# EAGLE board Proiect TSC (EAGLE 9.7.0)
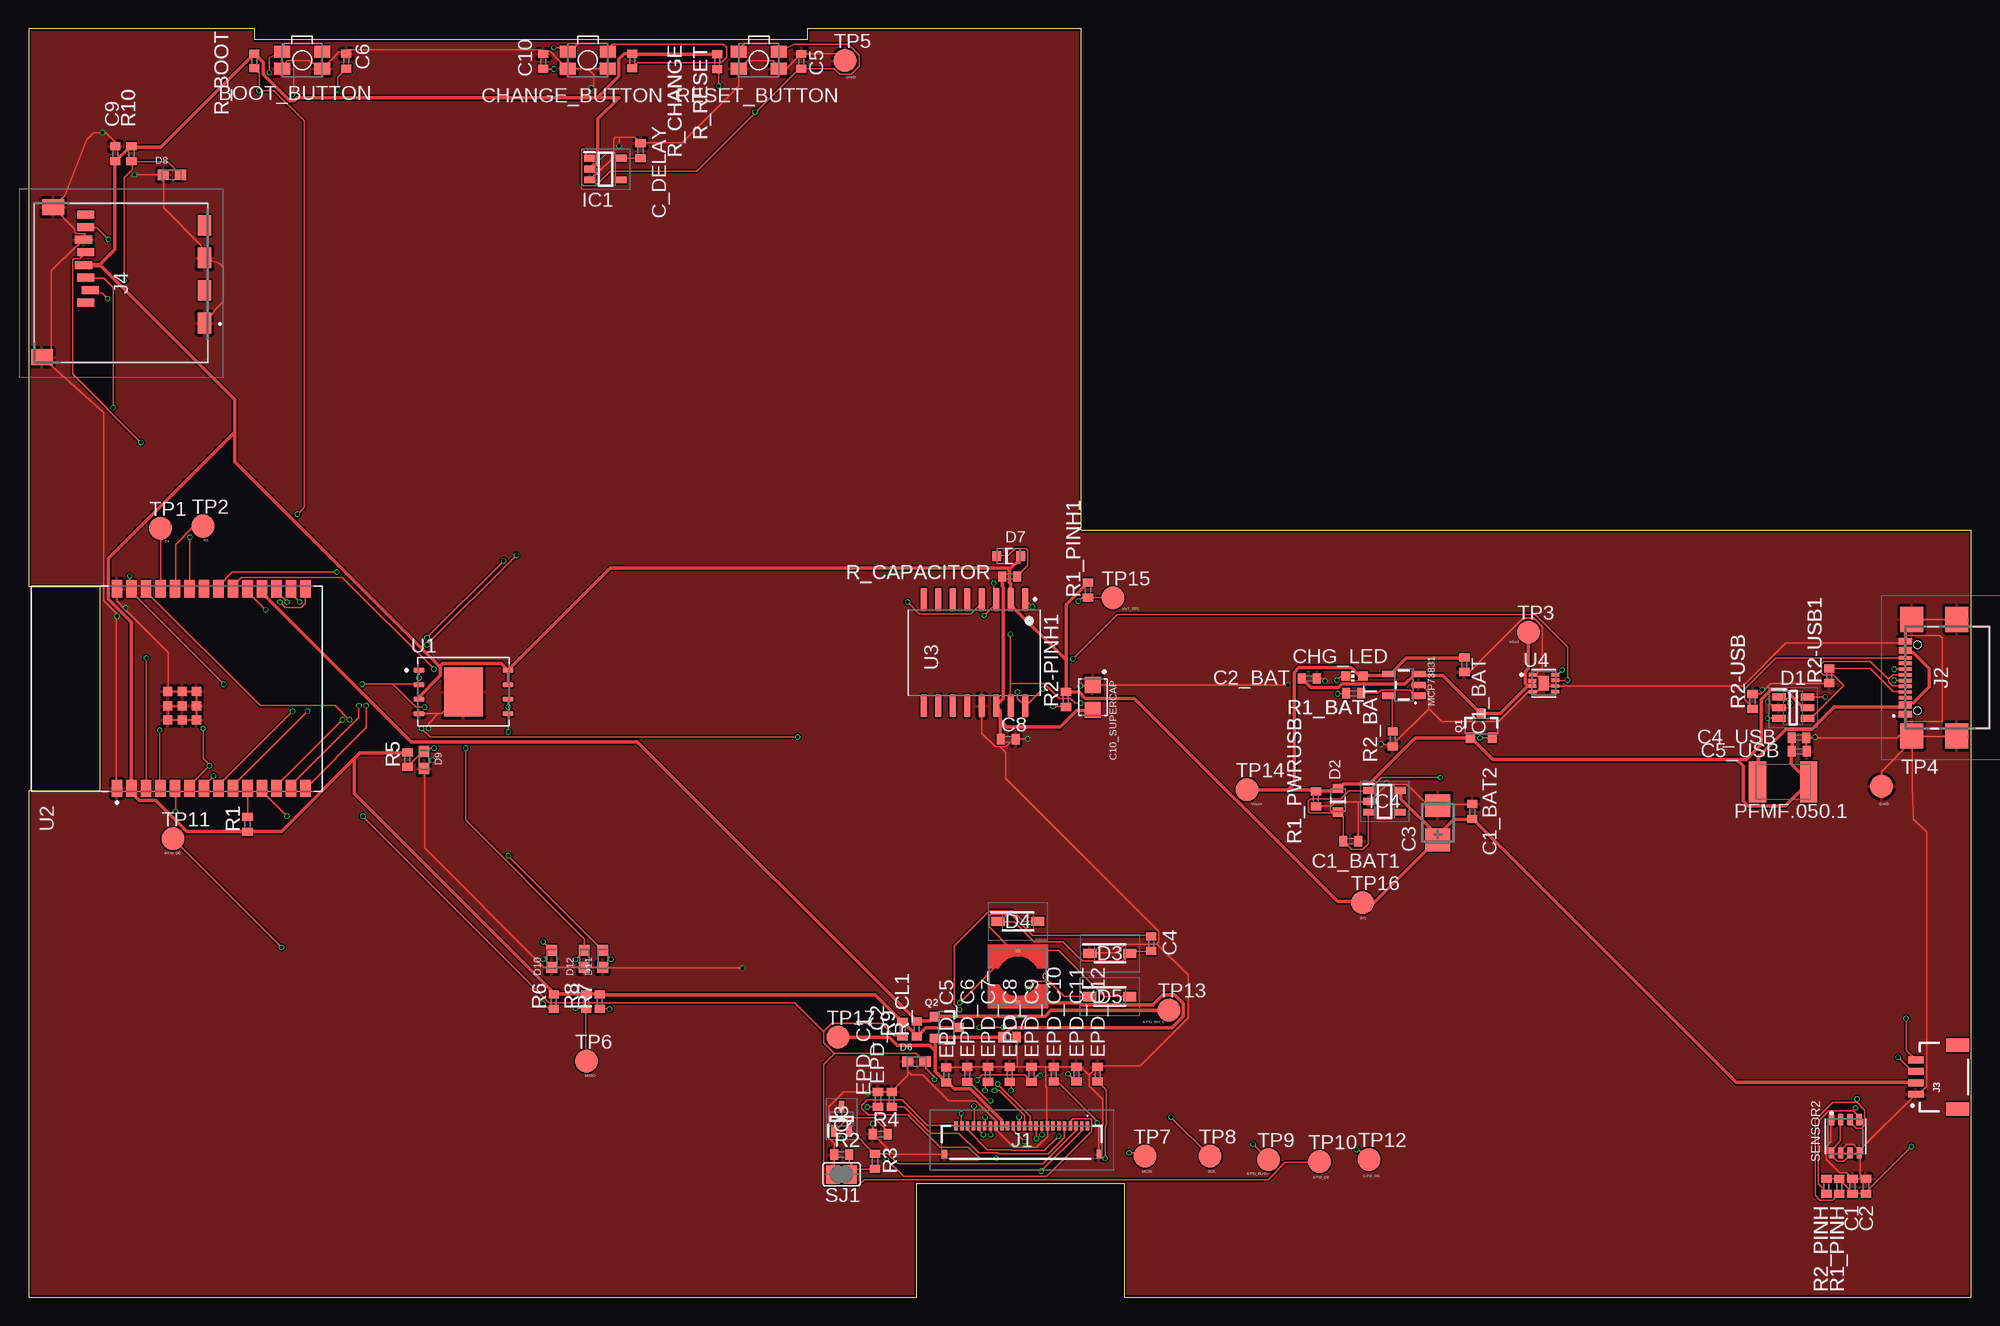
[diagram p1: board, top side]
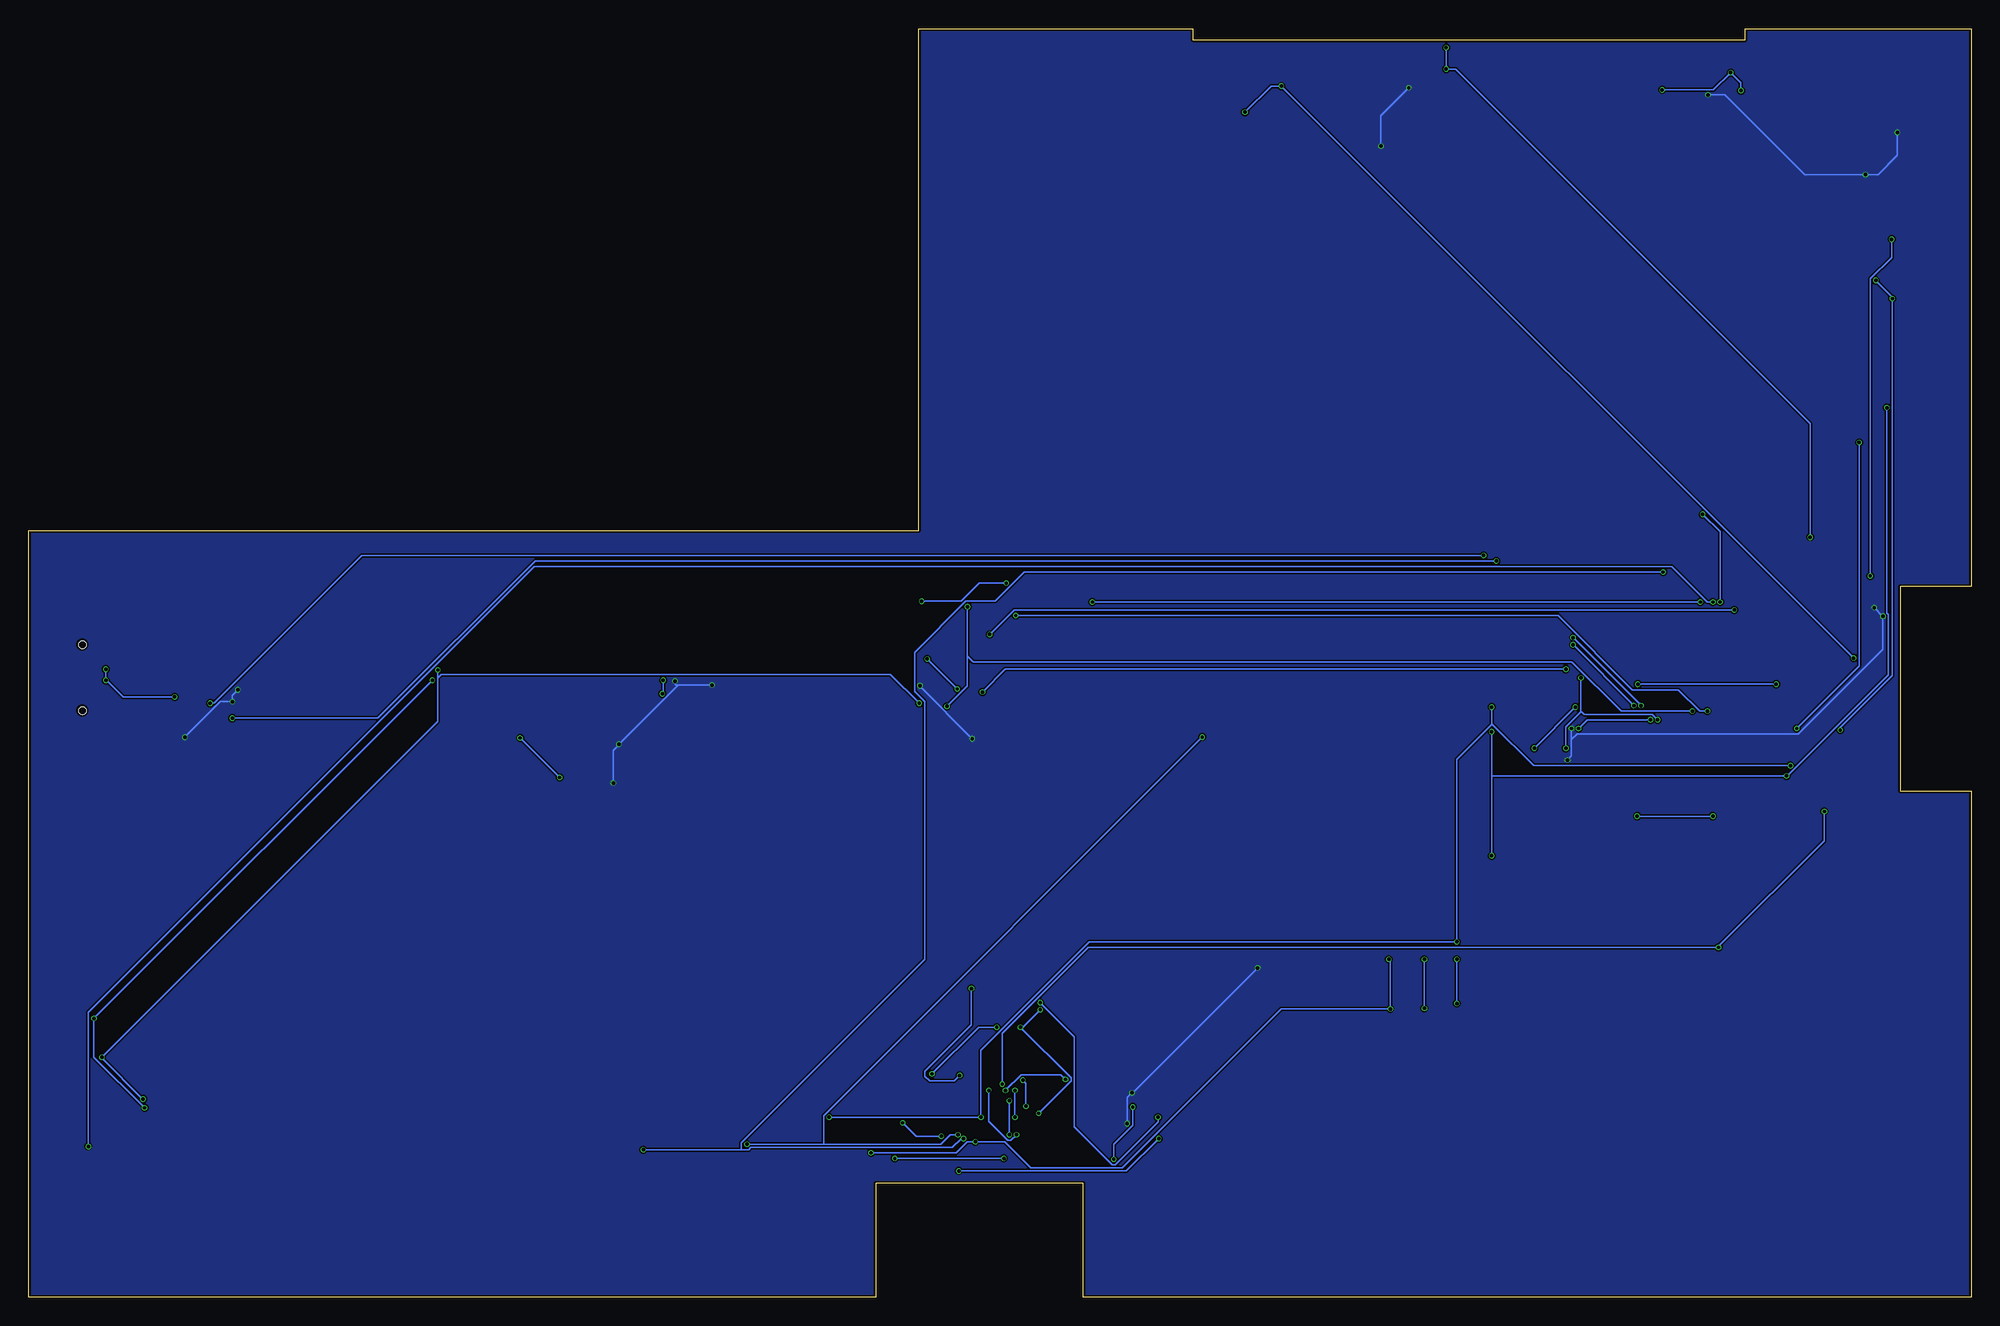
[diagram p2: board, bottom side, seen from below]

Size 170.2 x 111.2 mm. Coordinates in mm from the lower left corner, seen from the top.
Outline: 0,0 77.8,0 77.8,10 96,10 96,0 170.2,0 170.2,67.2 92.2,67.2 92.2,111.2 68.2,111.2 68.2,110.2 19.8,110.2 19.8,111.2 0,111.2 0,62.3 6.25,62.3 6.25,44.4 0,44.4 0,0
Copper layers (1*16): Top 0.035mm / dielectric 1.6mm / Bottom 0.035mm
Design rules "jlcpcb-2layers.dru": minimum track width 5mil, minimum drill 0.3mm, track to track 5mil, track to pad 5mil, pad to pad 5mil, via to via 5mil, smd to smd 5mil, copper to edge 0.2mm, drill to drill 6mil, minimum pad ring 10mil, minimum via ring 3mil, stop-mask expansion 4mil, vias tented up to drill 0mil, thermal gap 10mil
Net classes: 0 default: width 0.15 mm; 1 Power track: width 0.3 mm

## Footprints (pad centres in the part's own frame; a part is rotated, then mirrored left to right if it is on the bottom)
MYBUTTON = smd 1.4 x 1.05: 1 1.75,0.75; 2 -1.75,0.75; 3 -1.75,-0.75; 4 1.75,-0.75
EAGLE-LTSPICE_C0402 = smd 0.7 x 0.9: 1 -0.65,0; 2 0.65,0
RCL_CT3528 = smd 2 x 2.2: + -1.5,0; - 1.5,0
CAPCP3225X100N = smd 1.4 x 1.4: 1 -1.1,0; 2 1.1,0
ADAFRUIT_CHIP-LED0603 = smd 0.8 x 0.8: A 0,-0.75; C 0,0.75
SOT95P280X145-6N = smd 1.2 x 0.6: 1 -1.25,0.95; 2 -1.25,0; 3 -1.25,-0.95; 4 1.25,-0.95; 5 1.25,0; 6 1.25,0.95
ESP32_WROVER_AVX---SD0805S020S1R0_AVX_SD0805S020S1R0_0 = smd 0.8 x 0.9: 1 -1.05,0; 2 1.05,0
SOD3716X135N = smd 1.15 x 0.8: 1 -1.75,0; 2 1.75,0
DIOC1608X36N = smd 0.97 x 0.94: 1 -0.75,0; 2 0.75,0
SOT95P280X120-5N = smd 0.9 x 0.6: 1 -1.4,0.95; 2 -1.4,0; 3 -1.4,-0.95; 4 1.4,-0.95; 5 1.4,0.95
FH34SRJ24S05SH99 = smd 0.3 x 0.8: 1 5.75,1.45; 2 5.25,1.45; 3 4.75,1.45; 4 4.25,1.45; 5 3.75,1.45; 6 3.25,1.45; 7 2.75,1.45; 8 2.25,1.45; 9 1.75,1.45; 10 1.25,1.45; 11 0.75,1.45; 12 0.25,1.45; 13 -0.25,1.45; 14 -0.75,1.45; 15 -1.25,1.45; 16 -1.75,1.45; 17 -2.25,1.45; 18 -2.75,1.45; 19 -3.25,1.45; 20 -3.75,1.45; 21 -4.25,1.45; 22 -4.75,1.45; 23 -5.25,1.45; 24 -5.75,1.45 | smd 0.4 x 0.8: MP1 6.75,-1.05; MP2 -6.75,-1.05
SAMACSYS_PARTS_USB4110GFA = smd 0.3 x 1.15: A1 -3.35,3.678; A4 -2.55,3.678; A5 -1.25,3.678; A6 -0.25,3.678; A7 0.25,3.678; A8 1.25,3.678; A9 2.55,3.678; A12 3.35,3.678; B1 3.05,3.678; B4 2.25,3.678; B5 1.75,3.678; B6 0.75,3.678; B7 -0.75,3.678; B8 -1.75,3.678; B9 -2.25,3.678; B12 -3.05,3.678 | smd 2.18 x 2: MP1 -5.11,-0.827; MP2 5.11,-0.827; MP3 -5.11,3.103; MP4 5.11,3.103 | hole 0.65: -2.89,2.603; 2.89,2.603
JST04_1MM_RA = smd 0.6 x 1.35: 1 -1.5,0; 2 -0.5,0; 3 0.5,0; 4 1.5,0 | smd 1.2 x 2: NC1 2.8,-3.675; NC2 -2.8,-3.675
112ATAARR03ATTEND = smd 1.8 x 1.2: G1 10.6,10.4; G2 4.9,10.4; S1 7.75,10.4; S2 2.05,10.4 | smd 1.4 x 1.9: G3 13.6,-3.85; G4 0.45,-2.85 | smd 0.7 x 1.5: P1 8.8,0; P2 7.7,0.4; P3 6.6,0; P4 5.5,-0.2; P5 4.4,0; P6 3.3,-0.2; P7 2.2,0; P8 1.1,0
IND_4828-WE-TPC_WRE = smd 0.381 x 0.381: 1 -2.286,0; 2 2.286,0
ESP32_WROVER_SPARKFUN-IC-POWER_SOT23-5 = smd 0.55 x 1.2: 1 -0.95,-1.3; 2 0,-1.3; 3 0.95,-1.3; 4 0.95,1.3; 5 -0.95,1.3
ESP32C6_VARISTOR_CT/CN1812 = smd 1.5 x 3.6: 1 -2.25,0; 2 2.25,0
ESP32_WROVER_SPARKFUN-DISCRETESEMI_SOT23-3 = smd 0.8 x 0.9: 1 -0.95,-1; 2 0.95,-1; 3 0,1.1
SOT65P210X110-3N = smd 1.05 x 0.5: 1 -1.05,0.65; 2 -1.05,-0.65; 3 1.05,0
ESP32_WROVER_EAGLE-LTSPICE_R0402 = smd 0.7 x 0.9: 1 -0.65,0; 2 0.65,0
ESP32_WROVER_BME680_PSON80P300X300X100-8N = smd 1.016 x 0.5: 1 1.458,1.2; 2 1.458,0.4; 3 1.458,-0.4; 4 1.458,-1.2; 5 -1.458,-1.22; 6 -1.458,-0.4; 7 -1.458,0.4; 8 -1.458,1.2
SJ = smd 1.168 x 1.6: 1 -0.762,0; 2 0.762,0
TP20R = smd 2 x 2: TP 0,0
SON127P600X800X80-9N = smd 0.94 x 0.44: 1 -3.895,1.905; 2 -3.895,0.635; 3 -3.895,-0.635; 4 -3.895,-1.905; 5 3.895,-1.905; 6 3.895,-0.635; 7 3.895,0.635; 8 3.895,1.905 | smd 3.4 x 4.3: 9 0,0
XCVR_ESP32-C6-WROOM-1-N8 = smd 1.5 x 0.9: 1 -8.75,5.26; 2 -8.75,3.99; 3 -8.75,2.72; 4 -8.75,1.45; 5 -8.75,0.18; 6 -8.75,-1.09; 7 -8.75,-2.36; 8 -8.75,-3.63; 9 -8.75,-4.9; 10 -8.75,-6.17; 11 -8.75,-7.44; 12 -8.75,-8.71; 13 -8.75,-9.98; 14 -8.75,-11.25; 15 8.75,-11.25; 16 8.75,-9.98; 17 8.75,-8.71; 18 8.75,-7.44; 19 8.75,-6.17; 20 8.75,-4.9; 21 8.75,-3.63; 22 8.75,-2.36; 23 8.75,-1.09; 24 8.75,0.18; 25 8.75,1.45; 26 8.75,2.72; 27 8.75,3.99; 28 8.75,5.26 | smd 0.8 x 0.8: 29_1 -2.755,0.79; 29_2 -1.505,0.79; 29_3 -0.255,0.79; 29_4 -2.755,-0.46; 29_5 -1.505,-0.46; 29_6 -0.255,-0.46; 29_7 -2.755,-1.71; 29_8 -1.505,-1.71; 29_9 -0.255,-1.71
SOIC127P1032X265-16N = smd 2.05 x 0.59: 1 -4.655,4.445; 2 -4.655,3.175; 3 -4.655,1.905; 4 -4.655,0.635; 5 -4.655,-0.635; 6 -4.655,-1.905; 7 -4.655,-3.175; 8 -4.655,-4.445; 9 4.655,-4.445; 10 4.655,-3.175; 11 4.655,-1.905; 12 4.655,-0.635; 13 4.655,0.635; 14 4.655,1.905; 15 4.655,3.175; 16 4.655,4.445
SON50P200X200X80-9N = smd 0.76 x 0.27: 1 -0.985,0.75; 4 -0.985,-0.75; 5 0.985,-0.75; 6 0.985,-0.25; 7 0.985,0.25; 8 0.985,0.75 | smd 0.76 x 0.33: 2 -1.01,0.199; 3 -0.985,-0.25 | smd 0.9 x 1.3: 9 0,0

## Placement (x,y rotation side)
BOOT_BUTTON  BUTTON_CUSYOMV1  [MYBUTTON]  23.97,108.41 180 top
C1  100nF  [EAGLE-LTSPICE_C0402]  159.78,9.74 90 top
C1_BAT  4.7uF  [EAGLE-LTSPICE_C0402]  125.78,55.44 270 top
C1_BAT1  4.7uF  [EAGLE-LTSPICE_C0402]  115.83,39.98 0 top
C1_BAT2  4.7uF  [EAGLE-LTSPICE_C0402]  126.47,42.58 90 top
C2  100nF  [EAGLE-LTSPICE_C0402]  160.96,9.74 90 top
C2_BAT  4.7uF  [EAGLE-LTSPICE_C0402]  112.19,54.24 0 top
C3  100uF TANT  [RCL_CT3528]  123.46,41.59 90 top
C4  4.7uF/25V  [EAGLE-LTSPICE_C0402]  98.35,31 90 top
C4_USB  100nF  [EAGLE-LTSPICE_C0402]  155.09,49.06 0 top
C5  1uF  [EAGLE-LTSPICE_C0402]  67.69,108.32 90 top
C5_USB  4.7uF  [EAGLE-LTSPICE_C0402]  155.1,47.86 0 top
C6  100nF  [EAGLE-LTSPICE_C0402]  27.84,108.34 90 top
C7  10uF  [EAGLE-LTSPICE_C0402]  85.93,22.82 0 top
C8  100nF  [EAGLE-LTSPICE_C0402]  85.82,48.92 0 top
C9  100nF  [EAGLE-LTSPICE_C0402]  7.6,100.22 90 top
C10  100nF  [EAGLE-LTSPICE_C0402]  45.08,108.32 90 top
C10_SUPERCAP  CPH3225A  [CAPCP3225X100N]  93.23,52.58 270 top
C_DELAY  100nF  [EAGLE-LTSPICE_C0402]  53.61,100.5 90 top
CHANGE_BUTTON  BUTTON_CUSYOMV1  [MYBUTTON]  48.99,108.41 180 top
CHG_LED  [ADAFRUIT_CHIP-LED0603]  116.15,54.45 90 top
D1  USBLC6-2SC6Y  [SOT95P280X145-6N]  154.58,51.68 0 top
D2  SD0805S020S1R0  [ESP32_WROVER_AVX---SD0805S020S1R0_AVX_SD0805S020S1R0_0]  114.71,43.57 90 top
D3  MBR0530  [SOD3716X135N]  94.73,30.16 0 top
D4  MBR0530  [SOD3716X135N]  86.67,32.96 0 top
D5  MBR0530  [SOD3716X135N]  94.71,26.36 0 top
D6  PGB1010603MR  [DIOC1608X36N]  77.78,20.68 0 top
D7  ESP32_WROVER_AVX---SD0805S020S1R0_AVX_SD0805S020S1R0_0_0AVX_SD0805S020S1R0_0_0  [ESP32_WROVER_AVX---SD0805S020S1R0_AVX_SD0805S020S1R0_0]  85.86,64.97 0 top
D8  PGB1010603MR  [DIOC1608X36N]  12.56,98.38 0 top
D9  PGB1010603MR  [DIOC1608X36N]  34.65,47.11 90 top
D10  PGB1010603MR  [DIOC1608X36N]  45.83,29.66 90 top
D11  PGB1010603MR  [DIOC1608X36N]  50.31,29.66 90 top
D12  PGB1010603MR  [DIOC1608X36N]  48.69,29.66 90 top
EPD_C1  1uF/50V  [EAGLE-LTSPICE_C0402]  74.41,17.36 90 top
EPD_C2  1uF/50V  [EAGLE-LTSPICE_C0402]  75.62,17.36 90 top
EPD_C5  0.1uF/50V  [EAGLE-LTSPICE_C0402]  80.39,19.5 90 top
EPD_C6  1uF/50V  [EAGLE-LTSPICE_C0402]  82.23,19.56 90 top
EPD_C7  1uF/50V  [EAGLE-LTSPICE_C0402]  84.04,19.56 90 top
EPD_C8  1uF/50V  [EAGLE-LTSPICE_C0402]  85.95,19.56 90 top
EPD_C9  1uF/50V  [EAGLE-LTSPICE_C0402]  87.86,19.56 90 top
EPD_C10  1uF/50V  [EAGLE-LTSPICE_C0402]  89.81,19.58 90 top
EPD_C11  1uF/50V  [EAGLE-LTSPICE_C0402]  91.79,19.58 90 top
EPD_C12  1uF/50V  [EAGLE-LTSPICE_C0402]  93.65,19.58 90 top
IC1  BD5229G-TR  [SOT95P280X120-5N]  50.55,98.88 0 top
IC4  XC6220A331MR-G  [SOT95P280X120-5N]  118.79,43.48 0 top
J1  FH34SRJ-24S-0.5SH_99_  [FH34SRJ24S05SH99]  87.01,13.58 0 top
J2  SAMACSYS_PARTS_USB4110-GF-A  [SAMACSYS_PARTS_USB4110GFA]  168.08,54.31 90 top
J3  QWIIC_RIGHT_ANGLE  [JST04_1MM_RA]  165.32,19.32 90 top
J4  112A-TAAR-R03_ATTEND  [112ATAARR03ATTEND]  5.02,95.98 270 top
L1  68uH  [IND_4828-WE-TPC_WRE]  86.67,28.15 270 top
MCP73831  ESP32_WROVER_SPARKFUN-IC-POWER_MCP73831  [ESP32_WROVER_SPARKFUN-IC-POWER_SOT23-5]  120.48,53.68 90 top
PFMF.050.1  ESP32C6_VARISTORCN1812  [ESP32C6_VARISTOR_CT/CN1812]  153.71,45.18 0 top
Q1  20V/4.2A/52mΩ/1.4W  [ESP32_WROVER_SPARKFUN-DISCRETESEMI_SOT23-3]  127.27,50.06 0 top
Q2  20V/4.2A/52mΩ/1.4W  [ESP32_WROVER_SPARKFUN-DISCRETESEMI_SOT23-3]  80.39,23.66 270 top
Q3  SI1308EDL-T1-GE3  [SOT65P210X110-3N]  71.21,15.64 90 top
R1  10K  [ESP32_WROVER_EAGLE-LTSPICE_R0402]  19.18,41.46 90 top
R1_BAT  200  [ESP32_WROVER_EAGLE-LTSPICE_R0402]  116.1,52.94 0 top
R1_PINH  10K  [ESP32_WROVER_EAGLE-LTSPICE_R0402]  158.61,9.73 90 top
R1_PINH1  10K  [ESP32_WROVER_EAGLE-LTSPICE_R0402]  92.81,62 90 top
R1_PWRUSB  100k  [ESP32_WROVER_EAGLE-LTSPICE_R0402]  112.77,43.7 90 top
R2  2.2  [ESP32_WROVER_EAGLE-LTSPICE_R0402]  71.23,12.52 0 top
R2-PINH1  10K  [ESP32_WROVER_EAGLE-LTSPICE_R0402]  90.87,52.4 90 top
R2-USB  5k1  [ESP32_WROVER_EAGLE-LTSPICE_R0402]  151.02,52.24 90 top
R2-USB1  5k1  [ESP32_WROVER_EAGLE-LTSPICE_R0402]  157.75,54.48 90 top
R2_BAT  2K  [ESP32_WROVER_EAGLE-LTSPICE_R0402]  119.51,48.94 90 top
R2_PINH  10K  [ESP32_WROVER_EAGLE-LTSPICE_R0402]  157.49,9.73 90 top
R3  0.47  [ESP32_WROVER_EAGLE-LTSPICE_R0402]  74.15,11.92 90 top
R4  10k  [ESP32_WROVER_EAGLE-LTSPICE_R0402]  74.61,14.32 0 top
R5  10K  [ESP32_WROVER_EAGLE-LTSPICE_R0402]  33.19,47.12 90 top
R6  10K  [ESP32_WROVER_EAGLE-LTSPICE_R0402]  46.01,25.92 90 top
R7  10K  [ESP32_WROVER_EAGLE-LTSPICE_R0402]  50.03,25.92 90 top
R8  10K  [ESP32_WROVER_EAGLE-LTSPICE_R0402]  48.85,25.92 90 top
R9  10K  [ESP32_WROVER_EAGLE-LTSPICE_R0402]  76.57,23.52 90 top
R10  10K  [ESP32_WROVER_EAGLE-LTSPICE_R0402]  9.02,100.22 90 top
R_BOOT  10K  [ESP32_WROVER_EAGLE-LTSPICE_R0402]  19.78,108.36 90 top
R_CAPACITOR  15  [ESP32_WROVER_EAGLE-LTSPICE_R0402]  85.94,63.18 0 top
R_CHANGE  10K  [ESP32_WROVER_EAGLE-LTSPICE_R0402]  52.89,108.36 90 top
R_CL1  10K  [ESP32_WROVER_EAGLE-LTSPICE_R0402]  77.8,23.54 90 top
R_RESET  10K  [ESP32_WROVER_EAGLE-LTSPICE_R0402]  60.33,108.3 90 top
RESET_BUTTON  BUTTON_CUSYOMV1  [MYBUTTON]  63.98,108.41 180 top
SENSOR2  BME688  [ESP32_WROVER_BME680_PSON80P300X300X100-8N]  159.15,14.13 90 top
SJ1  [SJ]  71.22,10.78 0 top
TP1  TPTP20R  [TP20R]  11.56,67.4 0 top
TP2  TPTP20R  [TP20R]  15.28,67.6 0 top
TP3  TPTP20R  [TP20R]  131.4,58.3 0 top
TP4  TPTP20R  [TP20R]  162.32,44.8 0 top
TP5  TPTP20R  [TP20R]  71.54,108.4 0 top
TP6  TPTP20R  [TP20R]  48.86,20.7 0 top
TP7  TPTP20R  [TP20R]  97.79,12.38 0 top
TP8  TPTP20R  [TP20R]  103.51,12.38 0 top
TP9  TPTP20R  [TP20R]  108.63,12.08 0 top
TP10  TPTP20R  [TP20R]  113.09,11.9 0 top
TP11  TPTP20R  [TP20R]  12.64,40.2 0 top
TP12  TPTP20R  [TP20R]  117.44,12.1 0 top
TP13  TPTP20R  [TP20R]  99.89,25.2 0 top
TP14  TPTP20R  [TP20R]  106.74,44.5 0 top
TP15  TPTP20R  [TP20R]  94.99,61.3 0 top
TP16  TPTP20R  [TP20R]  116.84,34.6 0 top
TP17  TPTP20R  [TP20R]  70.89,22.8 0 top
U1  W25Q512JVEIQ  [SON127P600X800X80-9N]  38.1,53.06 0 top
U2  ESP32-C6-WROOM-1-N8  [XCVR_ESP32-C6-WROOM-1-N8]  13,53.35 90 top
U3  DS3231SN#  [SOIC127P1032X265-16N]  82.85,56.5 270 top
U4  MAX17048G+T10  [SON50P200X200X80-9N]  132.74,53.83 0 top

## Tracks (layer width: path | path; a pad name or v marks a point on that pad's centre or on a via)
3V3
  Top 0.3: D7.2 86.91,64.96 86.91,64.75 85.97,63.81 85.87,63.92 85.7,63.92 | 90.92,55.9 90.92,60.73 92.8,62.6 R1_PINH1.2 | 90.92,55.9 90.92,53.12 R2-PINH1.2 91.06,53.05 92.03,53.05 92.59,52.49 96.88,52.49 114.68,34.69 116.75,34.69 TP16.TP 116.89,34.62 117.86,34.62 123.27,40.03 C3.+ | IC4.5 120.22,44.39 120.22,43.7 123.4,40.51 123.4,40.1 C3.+ | C3.+ 123.54,40.58 124.86,41.9 126.45,41.9 C1_BAT2.1 126.59,41.83 149.58,18.84 165.3,18.84 J3.2 | 28.55,47.25 22.16,40.86 19.32,40.86 R1.1 19.11,40.86 13.85,40.86 11.15,43.56 9.7,43.56 9.07,44.18 9.07,44.6 U2.2 9,44.74 9,59.21 6.99,61.22 6.99,64.75 18.07,75.83 | 28.55,47.25 29.02,47.71 33.17,47.71 R5.2 | Q2.3 81.44,23.61 78.6,23.61 77.97,22.99 R_CL1.1 77.84,22.92 76.59,24.17 R9.2 76.45,24.24 74.17,26.52 50.14,26.52 R7.2 50,26.59 48.96,26.59 R8.2 48.82,26.59 46.05,26.59 R6.2 45.98,26.73 28.55,44.16 28.55,47.25 | R_RESET.2 52.95,108.95 R_CHANGE.2 52.2,108.98 51.72,108.5 51.72,107.02 51.55,106.86 51.52,106.86 49.8,105.14 | 36.08,55.33 36.08,54.5 34.21,52.63 34.21,52.49 U1.3 | 36.08,55.33 36.29,55.54 41.41,55.54 41.97,54.98 U1.8 | U1.7 42.03,53.74 42.03,54.85 U1.8 | 8.92,100.81 R10.2 | 36.08,55.33 35.94,55.4 18.07,73.27 18.07,75.83 | 85.7,63.92 50.97,63.92 42.1,55.05 U1.8 | 8.92,100.81 8.84,100.81 C9.1 7.55,99.44 7.55,91.82 6.23,90.51 4.88,90.51 J4.P4 6.36,90.38 18.07,78.67 18.07,75.83 | 8.92,100.81 11.58,100.81 R_BOOT.2 20.54,108.24 20.54,107.17 20.88,106.83 20.93,106.83 22.88,104.89 23.29,104.89 23.54,105.14 49.8,105.14 | 49.8,105.14 51.73,105.14 49.88,103.28 49.88,99.42 49.72,99.25 49.52,99.25 IC1.2 | 90.92,55.9 90.84,55.9 86.01,60.73 86.01,61.01 U3.2 86.03,62.55 85.92,62.66 85.92,63.74 85.75,63.91 85.71,63.91 85.7,63.92
12C_PW
  Top 0.15: SENSOR2.6 159.48,12.6 159.48,12.4 159,11.91 158.44,11.91 157.96,12.4 157.96,12.6 SENSOR2.8 157.96,12.74 157.96,12.95 158.72,13.71 158.72,15.58 SENSOR2.2
32KHZ  (via drill 0.3)
  Top 0.15: v89.75,51.8 90.86,51.8 R2-PINH1.1 | v87.95,60.52 87.32,61.15 U3.1 | v24.45,51.38 17.94,44.87 17.94,44.67 U2.9
  Bottom 0.15: v89.75,51.8 87.95,53.6 87.95,56.2 | v87.95,60.52 87.95,56.2 | v24.45,51.38 30.68,51.38 34.99,55.7 87.45,55.7 87.95,56.2
DN
  Top 0.15: 162.94,54.22 162.94,53.95 163.29,53.6 164.4,53.6 J2.B7 | 162.94,54.22 163.29,54.57 J2.A7 | D1.4 155.88,50.76 156.16,50.76 159.03,53.63 158.1,54.57 157.2,54.57 157.06,54.71 157.06,55.54 157.27,55.75 161.35,55.75 162.88,54.22 162.94,54.22
DP  (via drill 0.3)
  Top 0.15: v163.43,54.08 164.4,54.08 J2.A6 | v163.43,55.05 J2.B6 | v157.41,52.63 D1.6
  Bottom 0.15: v163.43,55.05 v163.43,54.08 163.36,54.08 161.91,52.63 v157.41,52.63
EPD_3V3
  Top 0.3: J1.15 85.73,15.03 85.32,15.03 J1.16 85.25,15.17 85.25,15.51 82.48,18.28 81.09,18.28 80.54,18.84 EPD_C5.1 80.33,18.91 79.43,19.8 79.43,21.6 | 79.43,21.6 79.43,22.64 Q2.2 79.5,22.78 85.25,22.78 C7.1 85.39,22.92 86.08,23.61 100.14,23.61 101.17,24.65 101.17,25.76 100.41,26.52 99.37,26.52 98.47,25.62 92.31,25.62 92.1,25.83 86.7,25.83 L1.2 | TP17.TP 70.91,22.78 75.41,22.78 76.1,22.1 78.93,22.1 79.43,21.6
EPD_3V3_C
  Top 0.3: U2.18 20.5,62.05 20.5,61.7 33.52,48.68 53.32,48.68 77.7,24.31 R_CL1.2 77.84,24.24 79.01,24.24 79.36,24.58 Q2.1 79.5,24.65 89.06,24.65 89.54,25.14 99.86,25.14 TP13.TP
EPD_BUSY  (via drill 0.3)
  Top 0.15: v88.78,14.27 88.78,15.03 J1.9 | v107.27,13.43 108.58,12.12 TP9.TP | v28.12,50.62 26.87,51.87 20.29,51.87 10.32,61.84 10.32,62.05 U2.26 | v34.42,49.86 35.18,49.1 v67.38,49.1
  Bottom 0.15: v88.78,14.27 89.47,14.27 90.3,13.43 100.55,13.43 | v107.27,13.43 100.55,13.43 | v28.12,50.62 33.66,50.62 v34.42,49.86 | v67.38,49.1 100.55,15.93 100.55,13.43
EPD_CS  (via drill 0.3)
  Top 0.15: v84.62,18.14 85.04,18.14 87.25,15.93 87.25,15.1 J1.12 | v79.36,19.11 79.36,19.32 78.6,20.08 78.6,20.64 D6.2 78.46,20.71 77.77,21.4 70.57,21.4 | 69.67,23.34 70.36,24.03 74.72,24.03 75.83,22.92 76.52,22.92 R9.1 | 69.67,23.34 69.67,22.3 70.57,21.4 | v22.64,42.17 20.5,44.32 20.5,44.6 U2.11 | v29.29,42.17 45.64,25.83 67.1,25.83 69.6,23.34 69.67,23.34 | TP10.TP 113.08,11.84 110.11,11.84 108.58,10.32 73.2,10.32 72.64,9.76 69.73,9.76 69.67,9.83 69.67,20.43 70.57,21.33 70.57,21.4
  Bottom 0.15: v84.62,18.14 83.24,19.53 79.78,19.53 v79.36,19.11 | v29.29,42.17 v22.64,42.17
EPD_DC  (via drill 0.3)
  Top 0.15: v84.9,18.7 87.74,15.86 87.74,15.1 J1.11 | v22.16,30.68 12.67,40.16 TP11.TP | v12.88,42.59 12.88,44.6 U2.5
  Bottom 0.15: v84.9,18.7 84.9,23.13 77.35,30.68 v22.16,30.68 22.16,30.75 12.88,40.03 v12.88,42.59
EPD_RST  (via drill 0.3)
  Top 0.15: v88.29,13.92 88.29,15.03 J1.10 | v116.34,12.95 116.55,12.95 117.38,12.12 TP12.TP | v27.01,63.57 17.87,63.57 16.69,62.39 16.69,62.12 U2.21
  Bottom 0.15: v88.29,13.92 88.5,13.92 89.26,13.16 106.92,13.16 107.13,12.95 107.75,12.95 | v116.34,12.95 107.75,12.95 | v27.01,63.57 82.96,63.57 85.52,61.01 88.09,61.01 92.59,56.51 92.59,53.12 91.69,52.22 91.69,29.64 107.75,13.57 107.75,12.95
FLASH_CS  (via drill 0.3)
  Top 0.15: R5.1 33.24,46.54 34.62,47.92 D9.2 34.69,47.92 34.9,48.13 v35.52,48.13 | v34.21,54.29 34.21,54.91 U1.1 | v27.49,50.62 21.74,44.87 21.74,44.67 U2.12
  Bottom 0.15: 34.21,51.31 v34.21,54.29 | 34.21,51.31 35.52,50 v35.52,48.13 | v27.49,50.62 27.98,51.11 33.93,51.11 34.14,51.31 34.21,51.31
GDR  (via drill 0.3)
  Top 0.15: v88.71,11.08 92.24,14.61 92.24,15.03 J1.2 | v71.19,13.92 70.57,14.54 Q3.1 70.64,14.54 71.81,15.72 74.1,15.72 75.21,14.61 75.21,14.34 R4.2
  Bottom 0.15: v88.71,11.08 74.03,11.08 v71.19,13.92
GND  (via drill 0.3)
  Top 0.15: J1.MP2 80.19,12.53 75.76,12.53 74.03,14.27 R4.1 73.96,14.34 v73.96,15.23 | SJ1.1 70.5,10.8 70.57,10.87 70.57,12.46 R2.1 70.57,12.53 70.57,13.5 70.08,13.99 70.08,16.69 71.4,18 73.54,18 | 77.01,19.8 77.01,19.46 75.62,18.07 EPD_C2.2 75.55,18 74.44,18 EPD_C1.2 74.37,18 73.54,18 | 77.01,19.8 77.01,20.64 D6.1 | v73.54,17.94 73.54,18 | EPD_C5.2 82.2,20.15 EPD_C6.2 82.27,20.22 84,20.22 EPD_C7.2 84.07,20.22 85.94,20.22 EPD_C8.2 86.01,20.22 86.63,20.22 | 86.63,20.22 87.81,20.22 EPD_C9.2 87.88,20.22 89.12,20.22 | 89.12,20.22 89.75,20.22 EPD_C10.2 89.89,20.22 91.76,20.22 EPD_C11.2 91.83,20.22 92.17,20.22 92.86,19.53 92.93,19.53 | 86.63,20.22 86.63,22.78 C7.2 | 89.12,20.22 89.12,18.49 89.19,18.42 89.19,15.1 J1.8 89.26,14.13 88.29,13.16 86.28,13.16 84.76,14.68 J1.17 84.69,15.1 84.69,15.51 82.96,17.24 80.61,17.24 78.35,19.5 77.31,19.5 77.01,19.8 | 85.1,48.27 84.69,48.27 83.52,49.44 83.52,51.8 U3.13 | 85.1,48.27 85.66,48.27 86.28,48.89 86.42,48.89 C8.2 86.49,48.96 v87.53,48.96 | 92.93,19.53 92.93,18.56 94.11,17.38 94.11,15.17 93.76,14.82 J1.MP1 | 92.93,19.53 93.63,20.22 EPD_C12.2 93.69,20.29 97.36,20.29 101.59,24.52 101.59,28.25 98.89,30.95 | 98.89,30.95 95.98,30.95 95.22,30.19 93,30.19 D3.1 | 98.89,30.95 98.89,31.02 99.03,31.16 99.03,32.06 85.6,45.49 85.6,47.77 85.1,48.27 | C1_BAT2.2 126.45,43.21 123.54,43.21 123.47,43.14 C3.- 123.4,43.14 122.57,43.14 120.77,44.94 118.97,44.94 | 116.48,43.42 117.38,43.42 IC4.2 117.45,43.42 118.97,44.94 | 116.48,43.42 114.47,43.42 114.12,43.07 112.81,43.07 R1_PWRUSB.1 | 116.48,43.42 116.48,40.03 C1_BAT1.2 | U4.9 132.68,53.81 132.68,53.67 132.13,53.12 131.78,53.12 U4.4 131.71,53.05 131.37,53.05 128.81,50.48 123.82,50.48 122.71,51.59 122.64,51.59
  Top 0.15: U4.9 132.75,53.88 132.06,54.57 131.78,54.57 U4.1 132.06,54.64 132.61,55.19 132.61,58.79 131.85,59.55 130.95,59.55 126.24,54.85 125.83,54.85 C1_BAT.2 | U4.9 132.68,53.6 133.72,53.6 U4.6 133.79,53.6 150.2,53.6 153.94,57.34 164.33,57.34 J2.B1 164.4,57.41 164.4,57.62 J2.A12 164.47,57.69 164.47,58.02 | 122.64,51.59 119.53,48.48 119.53,48.34 R2_BAT.1 119.46,48.48 v118.49,48.48 | 122.64,51.59 122.64,53.05 122.02,53.67 121.81,53.67 MCP73831.2 | v113.57,54.02 113.36,54.22 112.88,54.22 C2_BAT.2 | v110.31,53.67 93.28,53.67 C10_SUPERCAP.1 93.28,53.6 v92.1,53.6 | v118.97,45.08 118.97,44.94 | 160.45,10.39 160.94,10.39 C2.2 | 160.45,10.39 159.83,10.39 C1.2 159.76,10.46 159.28,10.94 158.65,10.94 157.47,12.12 157.47,13.23 157.89,13.64 157.89,15.58 SENSOR2.1 | SENSOR2.7 158.79,12.67 158.79,12.95 159.28,13.43 159.83,13.43 160.31,12.95 160.31,12.67 SENSOR2.5 | SENSOR2.5 160.38,12.88 165.3,17.8 J3.1 165.37,17.87 165.65,17.87 166.27,18.49 166.27,40.79 165.11,41.95 165.09,42.43 165.02,44.8 165.02,48.8 | 160.45,10.39 160.45,12.53 160.38,12.6 SENSOR2.5 | 151.97,53.15 152.63,53.81 157.68,53.81 R2-USB1.1 | 151.97,53.15 151.73,52.91 151.03,52.91 R2-USB.2 | v152.35,52.22 152.84,51.73 153.32,51.73 D1.2 | 151.97,53.15 v151.87,53.25 | 164.47,58.02 164.47,58.93 164.95,59.42 J2.MP4 165.02,59.42 J2.MP2 | C5_USB.2 155.74,47.92 155.74,49.03 C4_USB.2 155.81,49.03 156.5,49.03 | J2.B12 164.4,51.24 J2.A1 164.47,50.9 164.47,50.46 | 164.47,50.46 164.47,49.72 164.95,49.24 J2.MP3 | 156.5,49.03 163.71,49.03 164.4,49.72 J2.MP3 | 165.02,48.8 165.02,49.17 J2.MP3 | J2.MP1 168.9,49.17 165.09,49.17 J2.MP3
  Top 0.15: 164.47,58.02 167.41,58.02 167.63,57.81 167.63,50.46 164.47,50.46 | v156.5,49.1 156.5,49.03 | 35.9,51.18 36.22,51.18 38.09,53.05 U1.9 | 35.9,51.18 34.21,51.18 U1.4 | v35.39,47.09 34.69,46.4 D9.1 34.69,46.33 34.69,39.4 45.15,28.95 45.77,28.95 D10.1 45.84,28.95 48.68,28.95 D12.1 48.75,28.95 50.28,28.95 D11.1 50.34,28.88 v62.53,28.88 | 51.73,101.66 53.12,101.66 53.6,101.17 C_DELAY.2 53.67,101.17 57.27,101.17 62.23,106.13 62.23,107.6 RESET_BUTTON.1 | 51.73,101.66 51.38,101.66 51.24,101.52 51.24,99.94 49.68,98.38 49.6,98.38 IC1.3 | RESET_BUTTON.2 65.24,108.38 | TP5.TP 70.97,108.97 C5.2 | 23.24,108.38 24.55,108.38 BOOT_BUTTON.2 26.49,108.43 26.5,108.43 27.23,109.16 C6.2 27.98,109.35 44.98,109.35 C10.2 45.26,109.21 45.68,109.21 46.41,108.48 | 23.24,108.38 22.61,108.38 BOOT_BUTTON.1 | U2.29_5 13.43,51.8 12.33,51.8 U2.29_2 12.26,51.8 12.26,50.62 U2.29_1 12.33,50.62 13.43,50.62 U2.29_4 13.5,50.62 14.68,50.62 U2.29_7 14.75,50.62 14.75,51.8 U2.29_8 14.75,51.87 14.75,53.05 U2.29_9 14.68,53.12 13.5,53.12 U2.29_6 13.43,53.12 12.26,53.12 U2.29_3 12.26,53.18 12.26,56.51 8.41,60.35 | 8.41,60.35 7.76,61.01 7.76,62.05 U2.28 | J4.G1 16.27,86.41 16.27,86.49 17.04,87.25 17.04,90.3 16.76,90.58 J4.G2 15.15,92.19 11.84,95.49 11.84,98.33 D8.1 11.77,98.4 v9.28,98.4 | C9.2 7.6,101.25 | 7.69,59.69 7.69,59.97 6.58,61.08 6.58,77.54 J4.G3 2.01,82.82 2.01,89.96 4.18,92.14 4.27,92.14 J4.P6 4.96,92.83 4.96,93.23 4.18,93.23 4.06,93.35 4.06,93.64 J4.G4 3.17,96.54 5.1,101.47 5.72,102.09 v6.49,102.09 | 7.69,59.69 7.69,44.67 U2.1 | v8.52,60.45 8.41,60.35 | v7.76,59.69 7.69,59.69
  Top 0.15: 23.24,108.38 23.24,105.79 23.08,105.64 v23.08,105.39 | v51.73,100.9 51.73,101.66 | TP4.TP 162.32,46.1 165.02,48.8 | v35.04,49.86 35.04,50.32 35.9,51.18
  Top 0.152: 7.6,101.25 6.76,102.09 v6.49,102.09 | C5.2 66.38,107.66 RESET_BUTTON.2 | 49,107.66 CHANGE_BUTTON.1 47.23,107.66 46.41,108.48 | 49,107.66 CHANGE_BUTTON.2 | 65.24,108.38 63.01,108.38 62.23,107.6 | v49.3,106.01 49.5,106.21 49.5,107.16 49,107.66
  Bottom 0.15: v73.96,15.23 73.96,17.52 v73.54,17.94 73.47,17.94 v62.53,28.88 | v113.57,54.02 113.57,53.67 113.3,53.67 | 113.3,53.67 v110.31,53.67 | v118.97,45.08 118.97,47.92 118.49,48.41 v118.49,48.48 113.3,53.66 113.3,53.67 | v151.87,53.25 152.35,52.77 v152.35,52.22 153.39,52.22 v156.5,49.1 | v87.53,48.96 92.1,53.53 v92.1,53.6 | 35.04,48.9 35.04,47.44 v35.39,47.09 | 35.04,48.9 v35.04,49.86 | v6.49,102.09 6.49,100.09 8.17,98.4 v9.28,98.4 14.61,98.4 21.6,105.39 v23.08,105.39 | v8.52,60.45 v7.76,59.69 7.76,56.78 15.17,49.38 33.67,49.38 33.7,49.4 34.54,49.4 35.04,48.9 | v49.3,106.01 51.73,103.57 v51.73,100.9
  pour Top: 6.31,44.36 6.29,44.34 6.27,44.32 0.08,44.32 0.08,0.08 77.72,0.08 77.72,10.02 77.74,10.04 77.76,10.06 77.78,10.08 96.02,10.08 96.04,10.06 96.06,10.04 96.08,10.02 96.08,0.08 170.12,0.08 170.12,67.12 92.18,67.12 92.16,67.14 92.14,67.16 92.12,67.18 92.12,111.12 68.28,111.12 68.28,109.98 68.26,109.96 68.24,109.94 68.22,109.92 19.78,109.92 19.76,109.94 19.74,109.96 19.72,109.98 19.72,111.12 0.08,111.12 0.08,62.38 6.27,62.38 6.29,62.36 6.31,62.34 6.33,62.32 6.33,44.38
  pour Bottom: 6.31,44.36 6.29,44.34 6.27,44.32 0.08,44.32 0.08,0.08 77.72,0.08 77.72,10.02 77.74,10.04 77.76,10.06 77.78,10.08 96.02,10.08 96.04,10.06 96.06,10.04 96.08,10.02 96.08,0.08 170.12,0.08 170.12,67.12 92.18,67.12 92.16,67.14 92.14,67.16 92.12,67.18 92.12,111.12 68.28,111.12 68.28,109.98 68.26,109.96 68.24,109.94 68.22,109.92 19.78,109.92 19.76,109.94 19.74,109.96 19.72,109.98 19.72,111.12 0.08,111.12 0.08,62.38 6.27,62.38 6.29,62.36 6.31,62.34 6.33,62.32 6.33,44.38
  pour Top: 6.31,44.36 6.29,44.34 6.27,44.32 0.08,44.32 0.08,0.08 77.72,0.08 77.72,10.02 77.74,10.04 77.76,10.06 77.78,10.08 96.02,10.08 96.04,10.06 96.06,10.04 96.08,10.02 96.08,0.08 170.12,0.08 170.12,67.12 92.18,67.12 92.16,67.14 92.14,67.16 92.12,67.18 92.12,111.12 68.28,111.12 68.28,110.18 68.26,110.16 68.24,110.14 68.22,110.12 19.78,110.12 19.76,110.14 19.74,110.16 19.72,110.18 19.72,111.12 0.08,111.12 0.08,62.38 6.27,62.38 6.29,62.36 6.31,62.34 6.33,62.32 6.33,44.38
GPIO8
  Top 0.15: R1.2 19.18,42.17 19.18,44.6 U2.10
I2C_PW  (via drill 0.3)
  Top 0.15: R2_PINH.2 157.54,10.39 158.58,10.39 R1_PINH.2 158.65,10.32 159.83,9.14 | 159.83,9.14 160.94,9.14 C2.1 160.94,9.21 v164.95,13.23 | 159.83,9.14 C1.1 | v22.64,60.94 21.74,61.84 21.74,62.05 U2.17
  Bottom 0.15: v22.64,60.94 23.13,60.94 26.25,64.06 125.9,64.06 164.95,25 v164.95,13.23
INT_RTC  (via drill 0.3)
  Top 0.15: TP15.TP 94.94,61.35 92.86,61.35 R1_PINH1.1 92.8,61.29 92.24,61.29 v91.96,61.01 | v23.13,51.38 16.69,44.94 16.69,44.67 U2.8 | v83.72,59.76 84.69,60.73 84.69,61.15 U3.3 84.69,61.22 84.55,61.35 v84.55,62.6
  Bottom 0.15: v23.13,51.38 23.82,51.38 25.69,53.25 29.71,53.25 36.22,59.76 v83.72,59.76 | v91.96,61.01 88.5,61.01 86.91,62.6 v84.55,62.6
IO/BOOT  (via drill 0.3)
  Top 0.15: R_BOOT.1 20.19,107.3 v20.19,105.77 21.5,105.77 24.14,103.12 24.14,69.23 v23.55,68.63 | v21.09,107.34 21.09,108.62 BOOT_BUTTON.4 22.39,109.9 25.69,109.9 | C6.1 27.1,106.95 v27.1,105.82 | v22.02,60.94 22.51,60.45 23.89,60.45 24.24,60.8 24.24,62.05 U2.15
  Top 0.152: 25.69,109.9 25.72,109.87 BOOT_BUTTON.3
  Bottom 0.15: v20.19,105.77 20.19,106.44 v21.09,107.34 22.61,105.82 v27.1,105.82 | v22.02,60.94 22.02,67.1 v23.55,68.63
IO/CHANGE  (via drill 0.3)
  Top 0.15: 51.15,109.83 60.87,109.83 61.15,109.55 61.15,108.68 60.67,108.2 53.38,108.2 R_CHANGE.1 | v46.02,107.65 45.1,107.65 C10.1 | v46.02,109.53 46.97,109.53 | v14.13,66.62 14.13,62.12 U2.23 | 50.69,109.9 48.29,109.9 CHANGE_BUTTON.4
  Top 0.152: 50.69,109.9 50.74,109.85 50.74,109.42 | CHANGE_BUTTON.3 50.74,109.42 | 46.97,109.53 47.24,109.26 CHANGE_BUTTON.4 | 50.74,109.42 51.15,109.83
  Bottom 0.15: v46.02,109.53 v46.02,107.65 45.19,107.65 14.13,76.59 v14.13,66.62
MISO  (via drill 0.3)
  Top 0.15: TP6.TP 48.82,20.71 48.82,25.21 R8.1 48.75,25.21 48.61,25.35 v47.92,25.35 | v47.92,29.64 D12.2 48.68,30.47 48.68,31.44 38.3,41.83 v38.3,48.13 | v29.22,53.74 31.92,53.74 | 31.92,53.74 34.14,53.74 U1.2 | v17.11,53.74 9.07,61.77 9.07,62.05 U2.27 9,62.12 8.86,62.26 v8.86,63.23 | v6.99,92.72 5.96,93.76 5.02,93.76 J4.P7 | v34.69,51.73 33.93,51.73 31.92,53.74
  Bottom 0.15: v47.92,25.35 v47.92,29.64 | v17.11,53.74 v29.22,53.74 | v6.99,92.72 6.99,91.13 8.86,89.26 v8.86,63.23 | v34.69,51.73 v38.3,48.13
MOSI  (via drill 0.3)
  Top 0.15: v87.25,13.64 86.28,14.61 86.28,15.03 J1.14 | v96.4,12.67 97.5,12.67 97.78,12.4 TP7.TP | v50.9,25.28 50.07,25.28 R7.1 | v51.04,29.64 50.28,30.4 D11.2 50.28,30.47 v42.03,38.71 | v42.03,49.58 42.03,51.11 U1.5 | v16.2,45.7 15.37,44.87 15.37,44.67 U2.7 | v7.41,77.97 7.41,88.5 6.58,89.33 5.02,89.33 J4.P3
  Bottom 0.15: v96.4,12.67 88.92,12.67 87.95,13.64 v87.25,13.64 84.69,13.64 82.41,11.36 74.37,11.36 60.45,25.28 v50.9,25.28 50.9,29.5 v51.04,29.64 | v42.03,38.71 42.03,45.7 | 42.03,45.7 v42.03,49.58 | 42.03,45.7 v16.2,45.7 16.14,45.7 7.27,54.57 7.27,59.83 7.41,59.97 v7.41,77.97
N$1  (via drill 0.3)
  Top 0.15: v114.61,54.08 114.95,54.43 115.37,54.43 CHG_LED.C | v114.68,52.91 115.44,52.91 R1_BAT.1
  Bottom 0.15: v114.61,54.08 114.61,52.98 v114.68,52.91
N$2
  Top 0.15: R2-USB1.2 161.35,55.12 163.36,53.12 164.4,53.12 J2.A5
N$3  (via drill 0.3)
  Top 0.15: v84.76,12.19 83.31,12.19 82.34,13.16 79.84,13.16 77.01,16 73.54,16 72.99,16.55 72.99,16.83 73.47,17.31 76.52,17.31 78.74,15.1 81.23,15.1 J1.24 | v94.32,12.19 94.32,14.96 94.39,15.03 94.39,18.21 93.69,18.91 EPD_C12.1
  Bottom 0.15: v94.32,12.19 v84.76,12.19
N$4  (via drill 0.3)
  Top 0.15: IC4.3 117.38,39.75 116.89,39.27 115.92,39.27 115.23,39.96 C1_BAT1.1 115.16,40.03 115.16,42.1 114.75,42.52 D2.1 114.68,42.45 112.25,42.45 112.12,42.59 112.12,43.49 112.32,43.7 114.95,43.7 115.65,44.39 117.38,44.39 IC4.1 117.45,44.46 118.56,45.57 v123.68,45.57 | v127.14,49.03 128.18,49.03 Q1.2
  Bottom 0.15: v123.68,45.57 v127.14,49.03
N$5
  Top 0.15: C4.1 98.33,30.33 96.67,30.33 96.53,30.19 D3.2 96.47,30.12 95.84,29.5 92.31,29.5 90.65,31.16 88.09,31.16 86.36,32.89 84.97,32.89 D4.1
N$6
  Top 0.15: R1_BAT.2 116.75,52.98 118.21,52.98 118.49,53.25 120.98,53.25 121.47,52.77 121.74,52.77 MCP73831.1
N$8
  Top 0.15: R2_BAT.2 119.46,49.65 119.46,52.49 119.25,52.7 MCP73831.5
N$9
  Top 0.15: C_DELAY.1 53.6,99.86 53.59,99.83 IC1.5
N$10  (via drill 0.3)
  Top 0.15: v90.23,14.13 88.99,12.88 86.15,12.88 86.08,12.95 84,12.95 82.27,14.68 J1.22 | v93.63,15.3 93.63,15.44 90.16,18.91 89.82,18.91 EPD_C10.1
  Bottom 0.15: v90.23,14.13 92.45,14.13 v93.63,15.3
N$11
  Top 0.15: R2-USB.1 150.97,51.59 150.97,51.8 150.34,52.42 150.34,53.32 153.04,56.02 164.4,56.02 J2.B5
N$12
  Top 0.15: D7.1 84.83,65.03 85.8,65.03 86.42,65.65 87.39,65.65 87.53,65.51 87.53,64.13 86.63,63.23 R_CAPACITOR.2
N$13  (via drill 0.3)
  Top 0.15: v83.65,14.27 83.31,14.61 83.31,15.03 J1.20 | v86.08,18.14 86.08,18.84 86.01,18.91 EPD_C8.1
  Bottom 0.15: v83.65,14.27 84.14,13.78 84.42,13.78 86.08,15.44 v86.08,18.14
N$14  (via drill 0.3)
  Top 0.15: v83.79,15.79 83.79,15.1 J1.19 | v83.79,18.14 83.79,18.7 84,18.91 EPD_C7.1
  Bottom 0.15: v83.79,18.14 v83.79,15.79
N$15  (via drill 0.3)
  Top 0.15: v84.28,14.27 84.28,15.03 J1.18 | v84.28,17.24 84.07,17.24 82.41,18.91 82.27,18.91 EPD_C6.1
  Bottom 0.15: v84.28,17.24 v84.28,14.27
N$23
  Top 0.15: J1.5 90.72,15.03 90.72,13.99 89.33,12.6 84.97,12.6 84.9,12.67 83.24,12.67 81.51,14.4 79.01,14.4 76.73,16.69 75.62,16.69 EPD_C2.1
N$24  (via drill 0.3)
  Top 0.15: v75.14,12.12 76.66,10.6 89.19,10.6 93.14,14.54 93.14,15.51 93,15.65 91.48,15.65 91.27,15.44 91.27,15.1 J1.4 | v73.47,16.69 74.37,16.69 EPD_C1.1
  Bottom 0.15: v75.14,12.12 75.14,13.43 73.47,15.1 v73.47,16.69
PREVGH  (via drill 0.3)
  Top 0.15: v82.82,16.76 82.82,15.1 J1.21 | v83.1,19.04 83.38,19.32 83.38,19.39 83.52,19.53 87.25,19.53 87.81,18.97 EPD_C9.1 87.88,18.97 88.36,19.46 v88.64,19.46 | v87.6,27.08 88.22,27.7 89.4,27.7 90.72,26.38 92.93,26.38 D5.1
  Bottom 0.15: v82.82,16.76 82.82,18.77 v83.1,19.04 | v87.6,27.08 87.6,23.89 91.69,19.8 91.69,19.39 91.27,18.97 89.12,18.97 v88.64,19.46
PREVGL  (via drill 0.3)
  Top 0.15: v81.72,16.14 81.72,15.1 J1.23 | v85.39,23.68 v83.31,23.68 | v91.06,19.6 91.76,18.91 EPD_C11.1 | v81.58,25.21 81.09,25.69 81.09,30.82 84.14,33.86 86.22,33.86 87.12,32.96 88.36,32.96 D4.2
  Bottom 0.15: v81.72,16.14 78.88,18.97 78.88,19.25 v83.31,23.68 83.17,23.61 v81.58,25.21 | v85.39,23.68 86.98,23.68 v91.06,19.6
RESE
  Top 0.15: J1.3 91.76,14.61 88.85,11.7 76.17,11.7 75.28,12.6 74.17,12.6 R3.2 74.1,12.6 72.16,14.54 71.88,14.54 Q3.2
RESE'
  Top 0.15: R3.1 74.1,11.22 72.44,11.22 72.02,10.8 SJ1.2 72.44,11.29 71.88,11.84 71.88,12.46 R2.2
RESET  (via drill 0.3)
  Top 0.15: 65.72,109.9 62.7,109.9 RESET_BUTTON.4 | 63.67,103.84 67.48,107.64 C5.1 70.57,107.67 71.04,107.2 72.09,107.2 72.78,107.89 72.78,108.86 71.81,109.83 67.08,109.83 RESET_BUTTON.3 | 63.67,103.84 58.52,98.68 50.94,98.68 49.68,97.43 48.62,97.43 48.48,97.57 48.48,100.55 48.61,100.69 48.91,100.06 IC1.1 | v60.45,106.16 60.45,107.51 R_RESET.1 | v63.64,103.88 63.67,103.84 | v10.32,56.02 10.32,44.67 U2.3
  Top 0.152: 65.72,109.9 65.73,109.89 RESET_BUTTON.3
  Bottom 0.15: v60.45,106.16 | v60.45,106.16 v10.32,56.02 | v60.45,106.16 61.35,106.16 v63.64,103.88
RTC_RST  (via drill 0.3)
  Top 0.15: v23.75,60.94 22.99,61.7 22.99,62.05 U2.16 | v77.01,60.94 78.05,59.9 82.55,59.9 83.45,60.8 83.45,61.15 U3.4
  Bottom 0.15: v77.01,60.94 v23.75,60.94
RX
  Top 0.15: U2.24 12.88,62.12 12.88,66 14.47,67.59 15.23,67.59 TP2.TP
SCK  (via drill 0.3)
  Top 0.15: v86.77,15.79 86.77,15.1 J1.13 | v100.07,15.79 103.46,12.4 TP8.TP | v45.08,25.76 45.57,25.28 45.98,25.28 R6.1 | v45.08,29.64 45.84,30.4 D10.2 45.77,30.47 v45.08,31.16 | v42.03,51.73 42.03,52.42 U1.6 | U2.6 14.13,44.67 14.13,44.87 v15.86,46.6 15.86,46.67 15.3,47.23 v15.3,49.86 | J4.P5 4.47,91.04 3.98,91.04 3.86,90.92 3.86,80.9 v9.83,74.93
  Bottom 0.15: v100.07,15.79 v86.77,15.79 86.77,21.68 77.28,31.16 v45.08,31.16 45.08,47.16 42.03,50.21 | v45.08,29.64 v45.08,25.76 | 42.03,50.21 v42.03,51.73 | v15.86,46.6 38.36,46.6 41.97,50.21 42.03,50.21 | v9.83,74.93 9.83,55.33 v15.3,49.86
SCL  (via drill 0.3)
  Top 0.15: 159.83,16.34 157.68,16.34 156.78,15.44 156.78,9.97 157.47,9.28 157.47,9.14 R2_PINH.1 | 159.83,16.34 160.31,15.86 160.31,15.65 SENSOR2.4 | v164.47,24.45 164.47,21.68 165.3,20.84 J3.4 | U4.7 133.79,54.08 v134.83,54.08 134.83,56.99 131.99,59.83 95.36,59.83 v91.48,55.95 | v160.04,16.62 159.83,16.41 159.83,16.34 | v35.52,55.05 27.49,63.09 18.63,63.09 17.94,62.39 17.94,62.12 U2.20 | v86.63,53.05 86.63,52.49 87.25,51.87 U3.16 87.32,51.8 v88.85,53.32
  Bottom 0.15: v134.83,54.08 v164.47,24.45 164.47,21.05 v160.04,16.62 | v35.52,55.05 84.62,55.05 v86.63,53.05 | v88.85,53.32 v91.48,55.95
SDA  (via drill 0.3)
  Top 0.15: 160.18,17.11 158.03,17.11 156.5,15.58 156.5,8.93 156.92,8.52 158.03,8.52 158.58,9.07 R1_PINH.1 | 160.18,17.11 160.87,16.41 160.87,15.1 160.59,14.82 160.11,14.82 159.55,15.37 SENSOR2.3 | v134.34,54.98 134,54.64 133.79,54.64 U4.8 | v163.78,21.05 164.95,19.88 165.3,19.88 J3.3 | v160.18,17.38 160.18,17.11 | v20.77,60.25 19.18,61.84 19.18,62.05 U2.19 | 86.01,53.81 86.01,51.87 U3.15 | 86.01,53.81 v86.01,58.1 | v92.17,52.08 91.69,52.08 91.27,52.49 90.3,52.49 88.99,53.81 86.01,53.81
  Bottom 0.15: 134.34,54.3 134.34,50.48 v163.78,21.05 163.78,20.98 v160.18,17.38 | 134.34,54.3 v134.34,54.98 | v20.77,60.25 83.86,60.25 v86.01,58.1 | v92.17,52.08 94.7,54.6 134.04,54.6 134.34,54.3
SRC  (via drill 0.3)
  Top 0.15: 86.15,30.47 84.14,32.48 84.14,33.45 84.28,33.59 86.08,33.59 87.95,31.72 98.33,31.72 C4.2 | 86.15,30.47 86.63,30.47 L1.1 86.7,30.4 90.23,30.4 94.25,26.38 96.4,26.38 D5.2 | v71.26,15.79 71.26,16.69 Q3.3 | v81.58,25.83 86.15,30.4 86.15,30.47
  Bottom 0.15: v71.26,15.79 71.26,15.37 75,11.63 75.28,11.63 78.6,14.96 78.6,22.85 v81.58,25.83
SS_SD  (via drill 0.3)
  Top 0.15: D8.2 13.3,98.4 12.19,99.51 9.07,99.51 R10.1 9.07,99.44 9.07,98.82 8.38,98.13 v8.38,89.12 | v11.49,49.72 11.49,44.67 U2.4 | v6.92,87.53 6.45,88 J4.P2
  Bottom 0.15: v11.49,49.72 11.49,49.93 6.92,54.5 v6.92,87.53 6.92,87.67 v8.38,89.12
TX
  Top 0.15: U2.25 11.56,62.12 11.56,67.38 TP1.TP
USB_D+  (via drill 0.3)
  Top 0.15: D1.1 153.74,52.63 v154.29,52.08 | v34.9,57.2 v42.73,65.03 | v29.57,51.87 29.57,49.93 24.31,44.67 U2.14
  Bottom 0.15: v154.29,52.08 153.94,52.08 140.99,65.03 v42.73,65.03 | v29.57,51.87 v34.9,57.2
USB_D-  (via drill 0.3)
  Top 0.15: v152.35,50.76 153.32,50.76 D1.3 | v34.9,57.82 v41.62,64.54 | v28.95,51.87 28.95,50.83 22.99,44.87 22.99,44.67 U2.13
  Bottom 0.15: v152.35,50.76 139.61,50.76 125.83,64.54 v41.62,64.54 | v28.95,51.87 v34.9,57.82
VBAT
  Top 0.3: C2_BAT.1 111.56,54.22 112.32,53.46 114.75,53.46 115.02,53.74 120.56,53.74 121.39,54.57 121.74,54.57 MCP73831.3 121.88,54.5 123.89,54.5 127.14,51.24 Q1.3 127.28,51.18 128.94,51.18 131.3,53.53 | U4.2 131.78,54.02 131.78,53.6 U4.3 131.64,53.53 131.3,53.53 | TP3.TP 131.37,58.24 131.37,55.12 131.09,54.85 131.09,53.81 131.23,53.67 131.3,53.53
VBUS
  Top 0.3: C4_USB.1 154.5,49.03 154.5,47.92 C5_USB.1 154.43,47.71 154.43,46.74 155.88,45.29 PFMF.050.1.2 155.95,45.15 153.87,43.07 150.62,43.07 150.2,43.49 150.2,46.56 149.6,47.16 | D1.5 155.81,51.73 155.4,51.73 154.22,52.91 154.22,53.05 154.01,53.25 152.63,53.25 151.8,52.42 151.8,48.48 150.41,47.09 150.27,47.16 149.6,47.16 | C1_BAT.1 125.76,56.02 120.7,56.02 119.32,54.64 MCP73831.4 119.18,54.57 119.11,54.5 116.96,54.5 CHG_LED.A 116.75,54.5 116.55,54.5 115.86,55.19 111.28,55.19 110.87,54.78 110.87,45.13 110.9,45.1 110.9,45.06 110.3,44.46 | 110.3,44.46 112.67,44.46 R1_PWRUSB.2 112.81,44.39 114.47,44.39 114.68,44.6 D2.2 114.82,44.67 115.16,45.01 117.45,45.01 121.47,49.03 126.31,49.03 Q1.1 126.45,48.96 128.25,47.16 149.6,47.16 | 110.3,44.46 106.78,44.46 TP14.TP
VRTC
  Top 0.3: 85.11,50.6 85.11,51.45 84.76,51.8 U3.14 84.83,51.94 85.39,52.49 85.39,62.26 85.32,62.33 85.32,63.16 R_CAPACITOR.1 | 85.11,50.6 85.11,48.96 C8.1 | C10_SUPERCAP.2 93.21,51.45 91.83,51.45 90.37,50 85.71,50 85.11,50.6
VUSB
  Top 0.3: J2.A9 164.4,56.58 J2.B4 164.54,56.51 165.09,56.51 166.5,55.1 166.5,53.48 165.09,52.08 164.54,52.08 J2.B9 164.4,52.01 164.4,51.8 J2.A4 164.26,51.73 158.17,51.73 156.23,49.79 153.94,49.79 151.52,47.37 151.52,45.22 PFMF.050.1.1

## Text on the board
tNames: GND | TX | RX | INT_RTC | VBAT | VBUS | GND | EPD_DC | 3V3 | EPD_3V3_C | MISO | MOSI | SCK | EPD_BUSY | EPD_CS | EPD_RS